# EAGLE schematic yin_bit (EAGLE 9.2.2)
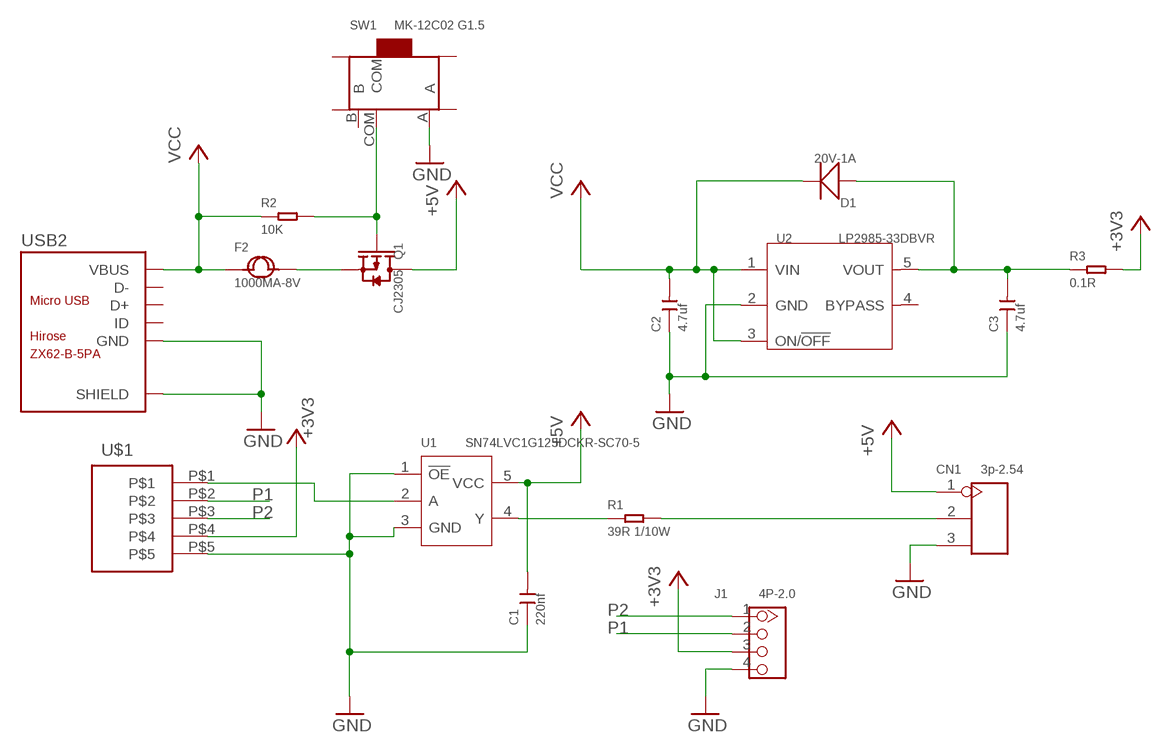
[diagram p0: schematic, sheet 1]

## Parts
C1  220nf  CERAMIC-220NF-25V-10%-X7R(0603)  [C0603]
C2  4.7uf  CERAMIC-4.7UF-10V-10%-X5R(0603)  [C0603]
C3  4.7uf  CERAMIC-4.7UF-10V-10%-X5R(0603)  [C0603]
CN1  3p-2.54  DIP-BLACK-MALE-HEADER-VERT(3P-2.54)  [H3-2.54]
D1  20V-1A  SMD-DIODE-SCHOTTKY-20V-1A(SOD-123)  [SOD-123]
F2  1000MA-8V  SMD-PPTC-1000MA-8V(1206)  [F1206]
J1  4P-2.0  GROVE-CONNECTOR-DIP(4P-2.0)  [HW4-2.0]
Q1  CJ2305  SMD-MOSFET-P-CH-8V-4.1A-CJ2305(SOT-23)  [SOT-23]
R1  39R 1/10W  SMD-RES-39R-5%-1/10W(0603)  [R0603]
R2  10K  SMD-RES-10K-1%-1/10W(0603)  [R0603]
R3  0.1R  SMD-RES-0.1R-5%-1/8W(0805)  [R0805]
SW1  MK-12C02 G1.5  SMD-TOGGLE-SWITCH-ON-ON(3+4P-6.7X2.7MM)  [SW7-SMD-L6.7X2.7X3.2MM]
U1  SN74LVC1G125DCKR-SC70-5  LOGIC-SN74LVC1G125DCKR(SC70-5)  [SC-70-5]
U2  LP2985-33DBVR  PMIC-LP2985-33DBVR(SOT23-5)  [SOT-23-5]
U$1  MICROBIT-HOLL  [MICROBIT-HOLL]
USB2  ZX62-B-5PA  MICRO-USB-SMD(ZX62-B-5PA)  [MICRO-USB5+6P-SMD-0.65-AB]

## Nets
+3V3: J1.3 R3.2 U$1.P$4
+5V: C1.2 CN1.1 Q1.3(D) U1.5(VCC)
GND: C1.1 C2.1 C3.1 CN1.3 J1.4 SW1.A U1.1(!OE!) U1.3(GND) U2.2(GND) U$1.P$5 USB2.5(GND) USB2.P1(SHIELD) USB2.P2(SHIELD) USB2.P3(SHIELD) USB2.P4(SHIELD) USB2.P5(SHIELD) USB2.P6(SHIELD)
N$1: U1.2(A) U$1.P$1
N$2: R1.1 U1.4(Y)
N$3: CN1.2 R1.2
N$4: Q1.1(G) R2.2 SW1.COM
N$5: F2.2 Q1.2(S)
N$6: C3.2 D1.+ R3.1 U2.5(VOUT)
P1: J1.2 U$1.P$2
P2: J1.1 U$1.P$3
VCC: C2.2 D1.- F2.1 R2.1 U2.1(VIN) U2.3(ON/!OFF) USB2.1(VBUS)
Unconnected: SW1.B SW1.SS1 SW1.SS2 SW1.SS3 SW1.SS4 U2.4(BYPASS) USB2.2(D-) USB2.3(D+) USB2.4(ID)

## Library data of the parts
C1 = Seeed-Capacitor:CERAMIC-220NF-25V-10%-X7R(0603): 302010073; MPN: CC0603KRX7R8BB224
C2 C3 = Seeed-Capacitor:CERAMIC-4.7UF-10V-10%-X5R(0603): 302010111; MPN: CC0603KRX5R6BB475
CN1 = Seeed-Connector:DIP-BLACK-MALE-HEADER-VERT(3P-2.54): 320020079
D1 = Seeed-Diode:SMD-DIODE-SCHOTTKY-20V-1A(SOD-123): 304020034; MPN: B5819W
F2 = Seeed-Fuse:SMD-PPTC-1000MA-8V(1206): 307010001; MPN: KT8-1000SMD1206
J1 = Seeed-OPL-Connector:GROVE-CONNECTOR-DIP(4P-2.0): 320110033
Q1 = Seeed-Transistor:SMD-MOSFET-P-CH-8V-4.1A-CJ2305(SOT-23): 305030014; MPN: CJ2305
R1 = Seeed-OPL-Resistor:SMD-RES-39R-5%-1/10W(0603): 301010138; MPN: RC0603JR-0739RL
R2 = Seeed-Resistor:SMD-RES-10K-1%-1/10W(0603): 301010299; MPN: RC0603FR-0710KL
R3 = Seeed-Resistor:SMD-RES-0.1R-5%-1/8W(0805): 301010264; MPN: RL0805JR-070R1L
SW1 = Seeed-Switch:SMD-TOGGLE-SWITCH-ON-ON(3+4P-6.7X2.7MM): 311030001; MPN: MK-12C02 G1.5
U1 = Seeed-OPL-ic:LOGIC-SN74LVC1G125DCKR(SC70-5): 310050019; MPN: SN74LVC1G125DCKR
U2 = Seeed-OPL-ic:PMIC-LP2985-33DBVR(SOT23-5): 310030033; MPN: LP2985-33DBVR
U$1 = Seeed-Connector:MICROBIT-HOLL
USB2 = Seeed-OPL-Connector:MICRO-USB-SMD(ZX62-B-5PA): 320010005; MPN: ZX62-B-5PA